# EAGLE design aux (EAGLE 9.6.2)
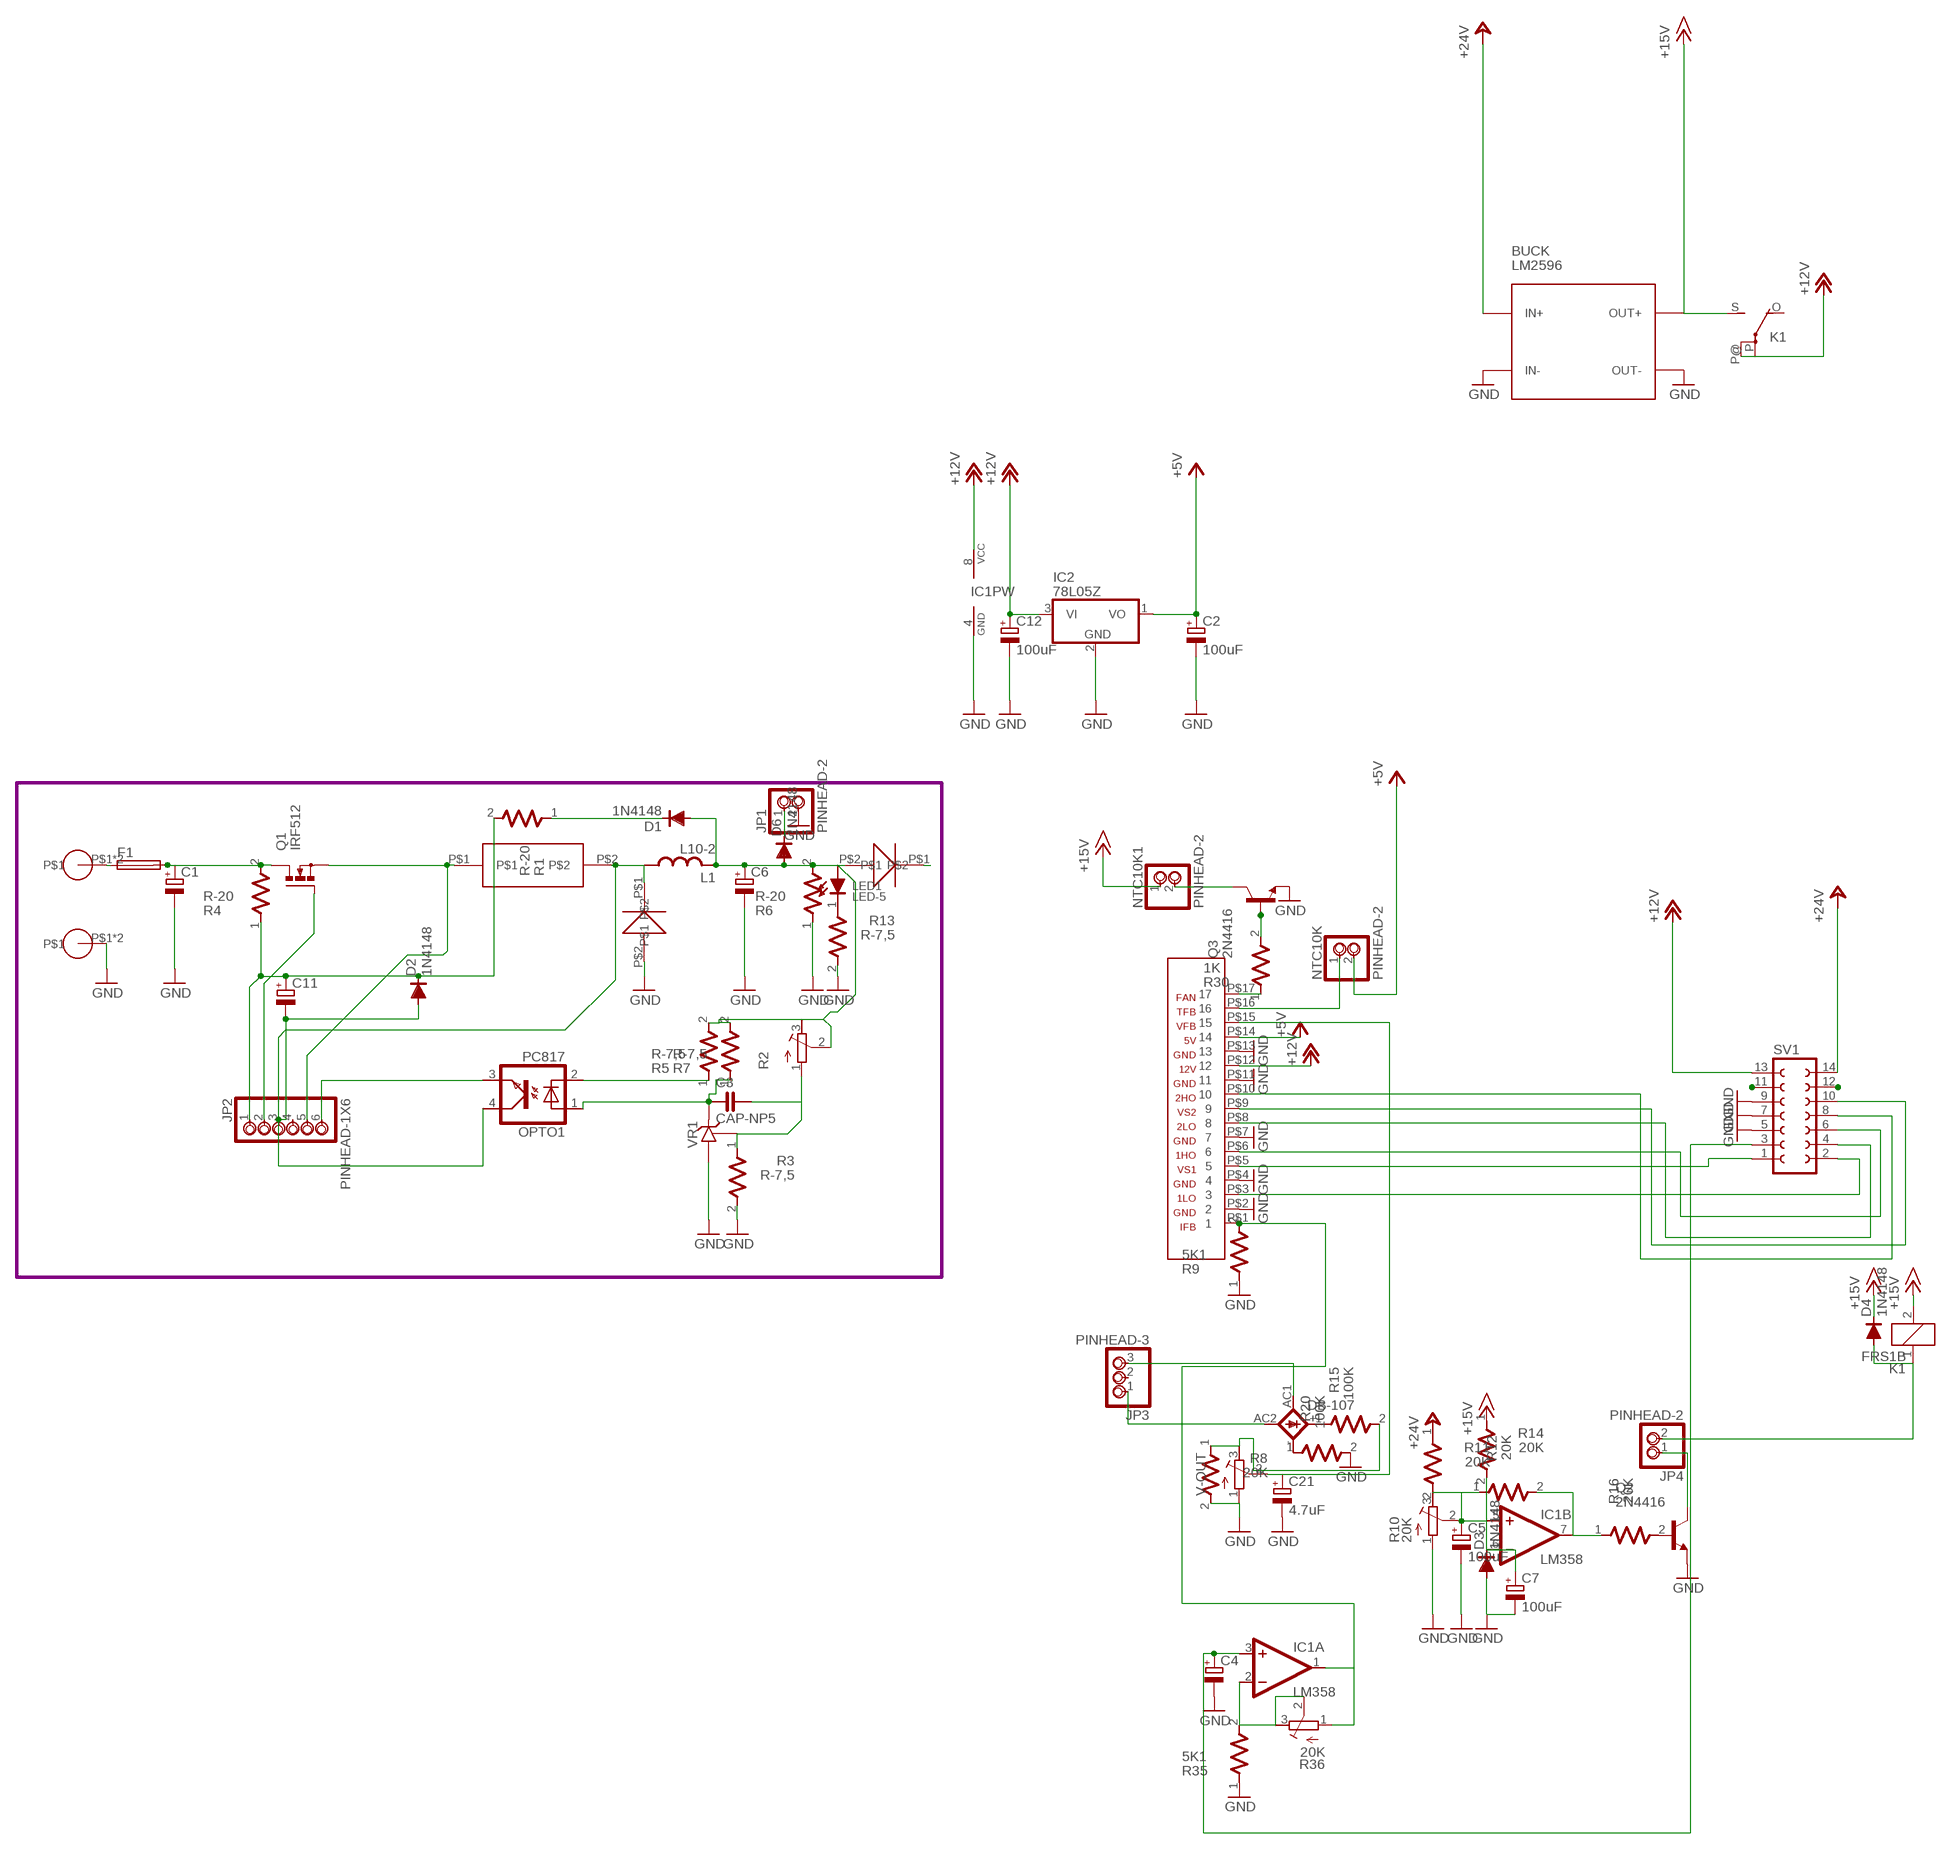
[diagram p0: schematic, sheet 1]

## Parts
BUCK  LM2596  DC-DC-STEP-DOWN-LM2596  [DC-DC-STEP-DOWN-LM2596]
C1  CPOL-EUE7.5-18  [E7,5-18]
C2  100uF  CPOL-EUE2.5-7  [E2,5-7]
C3  CAP-NP5  [CAP-NP5]
C4  CPOL-EUE2.5-7  [E2,5-7]
C5  100uF  CPOL-EUE2.5-7  [E2,5-7]
C6  CPOL-EUE7.5-18  [E7,5-18]
C7  100uF  CPOL-EUE2.5-7  [E2,5-7]
C11  CPOL-EUE5-8.5  [E5-8,5]
C12  100uF  CPOL-EUE2.5-7  [E2,5-7]
C21  4.7uF  CPOL-EUE2.5-7  [E2,5-7]
D1  1N4148  [D-7,5]
D2  1N4148  [D-7,5]
D3  1N4148  [D-7,5]
D4  1N4148  [D-7,5]
D6  1N4148  [D-7,5]
DB-107  CAU-1A  [CAU-1A]
F1  SH22  [SH22]
IC1  LM358  [DIL-8]
IC2  78L05Z  [TO92]
JP1  PINHEAD-2  [PINHEAD-2]
JP2  PINHEAD-1X6  [PINHEAD-1X6]
JP3  PINHEAD-3  [PINHEAD-3]
JP4  PINHEAD-2  [PINHEAD-2]
K1  FRS1B  [FRS1B]
L1  L10-2  [L10-2]
LED1  LED-5  [LED5]
NTC10K  PINHEAD-2  [PINHEAD-2]
NTC10K1  PINHEAD-2  [PINHEAD-2]
OPTO1  PC817  [DIL-04]
Q1  IRF512  [TO220BV]
Q2  2N4416  [TO92]
Q3  2N4416  [TO92]
R1  R-20  [R-20]
R2  R-TRIMM64W  [RTRIM64W]
R3  R-7,5  [R-7,5]
R4  R-20  [R-20]
R5  R-7,5  [R-7,5]
R6  R-20  [R-20]
R7  R-7,5  [R-7,5]
R8  20K  R-7,5  [R-7,5]
R9  5K1  R-7,5  [R-7,5]
R10  20K  R-TRIMM64W  [RTRIM64W]
R11  20K  R-7,5  [R-7,5]
R12  20K  R-7,5  [R-7,5]
R13  R-7,5  [R-7,5]
R14  20K  R-7,5  [R-7,5]
R15  100K  R-7,5  [R-7,5]
R16  20K  R-7,5  [R-7,5]
R20  100K  R-7,5  [R-7,5]
R30  1K  R-7,5  [R-7,5]
R35  5K1  R-7,5  [R-7,5]
R36  20K  R-TRIMM64W  [RTRIM64W]
SV1  FE07-2  [FE07-2]
U$1  DSEI6060A  [DSEI6060A]
U$2  DSEI6060A  [DSEI6060A]
U$3  PIN5MM  [PIN5MM]
U$4  PIN5MM  [PIN5MM]
U$5  SHUNT-0.01R  [SHUNT-0.01R]
U$11  EGS002  [EGS002]
V-OUT  R-TRIMM64W  [RTRIM64W]
VR1  TL431CLP  [TO92-CLP]

## Nets
+5V: C2.+ IC2.1(VO) NTC10K.2 U$11.P$14
+12V: C12.+ IC1.8(PW:VCC) IC2.3(VI) K1.P(2:P) K1.P@(2:P) SV1.13 U$11.P$12
+15V: BUCK.OUT+ D4.C K1.2 K1.S(2:S) NTC10K1.1 R14.1
+24V: BUCK.IN+ R11.1 SV1.14
GND: BUCK.IN- BUCK.OUT- C1.- C2.- C4.- C5.- C6.- C7.- C12.- C21.- D3.A IC1.4(PW:GND) IC2.2(GND) JP1.2 Q2.3(E) Q3.3(E) R3.2 R6.1 R8.2 R9.1 R10.1(A) R13.2 R20.2 R35.1 SV1.5 SV1.7 SV1.9 U$1.P$2 U$3.P$1 U$3.P$2 U$11.P$2 U$11.P$4 U$11.P$7 U$11.P$11 U$11.P$13 V-OUT.1(A) VR1.A
N$1: F1.1 U$4.P$1 U$4.P$2
N$3: JP2.2 Q1.G
N$4: D1.C R1.1
N$5: LED1.K R13.1
N$6: C5.+ IC1.5(B:+IN) R10.2(S) R10.3(E) R11.2 R12.1
N$7: OPTO1.2(C) R5.1
N$8: C4.+ IC1.3(A:+IN) SV1.3
N$9: SV1.11
N$10: C11.+ D2.C JP2.1 R1.2 R4.1
N$11: SV1.12
N$12: C3.2 R2.1(A) R3.1 VR1.R
N$13: SV1.2 U$11.P$3
N$14: JP2.5 Q1.S U$5.P$1
N$16: C1.+ F1.2 Q1.D R4.2
N$17: C3.1 OPTO1.1(A) R7.1 VR1.C
N$18: C6.+ D1.A D6.A L1.P$3 L1.P$4 LED1.A R2.2(S) R2.3(E) R5.2 R6.2 R7.2 U$2.P$2
N$19: R8.1 R15.2 V-OUT.3(E)
N$20: SV1.6 U$11.P$6
N$21: D6.C JP1.1
N$22: SV1.4 U$11.P$8
N$23: IC1.2(A:-IN) R35.2 R36.2(S) R36.3(E)
N$24: SV1.10 U$11.P$9
N$25: SV1.8 U$11.P$10
N$26: R30.1 U$11.P$17
N$27: DB-107.AC2(-) JP3.1
N$28: IC1.7(B:OUT) R12.2 R16.1
N$29: C7.+ D3.C IC1.6(B:-IN) R14.2
N$30: C11.- D2.A JP2.3 L1.P$1 L1.P$2 OPTO1.4(COL) U$1.P$1 U$5.P$2
N$31: Q2.2(B) R16.2
N$32: JP4.1 Q2.1(C)
N$33: D4.A JP4.2 K1.1
N$35: SV1.1 U$11.P$5
N$36: JP2.6 OPTO1.3(EMI)
N$37: Q3.2(B) R30.2
N$40: C21.+ U$11.P$15 V-OUT.2(S)
N$41: NTC10K1.2 Q3.1(C)
N$45: DB-107.+ R15.1
N$47: DB-107.-(AC2) R20.1
N$48: NTC10K.1 U$11.P$16
N$51: IC1.1(A:OUT) R9.2 R36.1(A) U$11.P$1
N$53: DB-107.AC1 JP3.3
VCC: U$2.P$1
Unconnected: JP2.4 JP3.2 K1.O(2:O)

## Library data of the parts
BUCK = diy-modules:DC-DC-STEP-DOWN-LM2596: DC/DC Step-Down Regulator based on LM2596-ADJ chip LM2596 datasheet available here: http://www.ti.com/lit/ds/symlink/lm2596.pdf Click here to find device on ebay.com <http://www.ebay.com/sch/lm2596+power+regulator>
C1 C2 C4-C7 C11 C12 C21 = LBR inverter true sine:CPOL-EU: POLARIZED CAPACITOR, European symbol
C3 = chuong:CAP-NP5
D1-D4 D6 = chuong:1N4148
DB-107 = lbr:CAU-1A
F1 = fuse:SH22: FUSE HOLDER CS PFP30, Schukat; OC_FARNELL: unknown; OC_NEWARK: unknown
IC1 = LBR inverter true sine:LM358
IC2 = chuong:78*: Positive VOLTAGE REGULATOR Source: http://cache.national.com/ds/LM/LM78L05.pdf http://www.fairchildsemi.com/ds/LM/LM7805.pdf
JP1 JP4 = chuong:PINHEAD-2
JP2 = chuong:PINHEAD-1X6
JP3 = chuong:PINHEAD-3
K1 = relay:FRS1B: RELAY 1 x switch, same as V23101-D6-A201, Siemens; OC_FARNELL: unknown; OC_NEWARK: unknown
L1 = lbr:L10-2
LED1 = chuong:LED-5
NTC10K NTC10K1 = LBR inverter true sine:PINHEAD-2
OPTO1 = chuong:PC817
Q1 = LBR inverter true sine:IRF512: N-CHANNEL MOS FET
Q2 Q3 = lbr:2N4416: NPN Transistor
R1 R4 R6 = chuong:R-20
R2 R10 R36 V-OUT = chuong:R-TRIMM: Trimm resistor
R3 R5 R7-R9 R11-R16 R20 R30 R35 = chuong:R-7,5
SV1 = con-lsta:FE07-2: FEMALE HEADER; OC_FARNELL: unknown; OC_NEWARK: unknown
U$1 U$2 = LBR-NEW:DSEI6060A
U$3 U$4 = LBR inverter true sine:PIN5MM
U$5 = Shunt 0.01R:SHUNT-0.01R
U$11 = LBR inverter true sine:EGS002
VR1 = chuong:TL431CLP: VOLTAGE REGULATOR

## Board
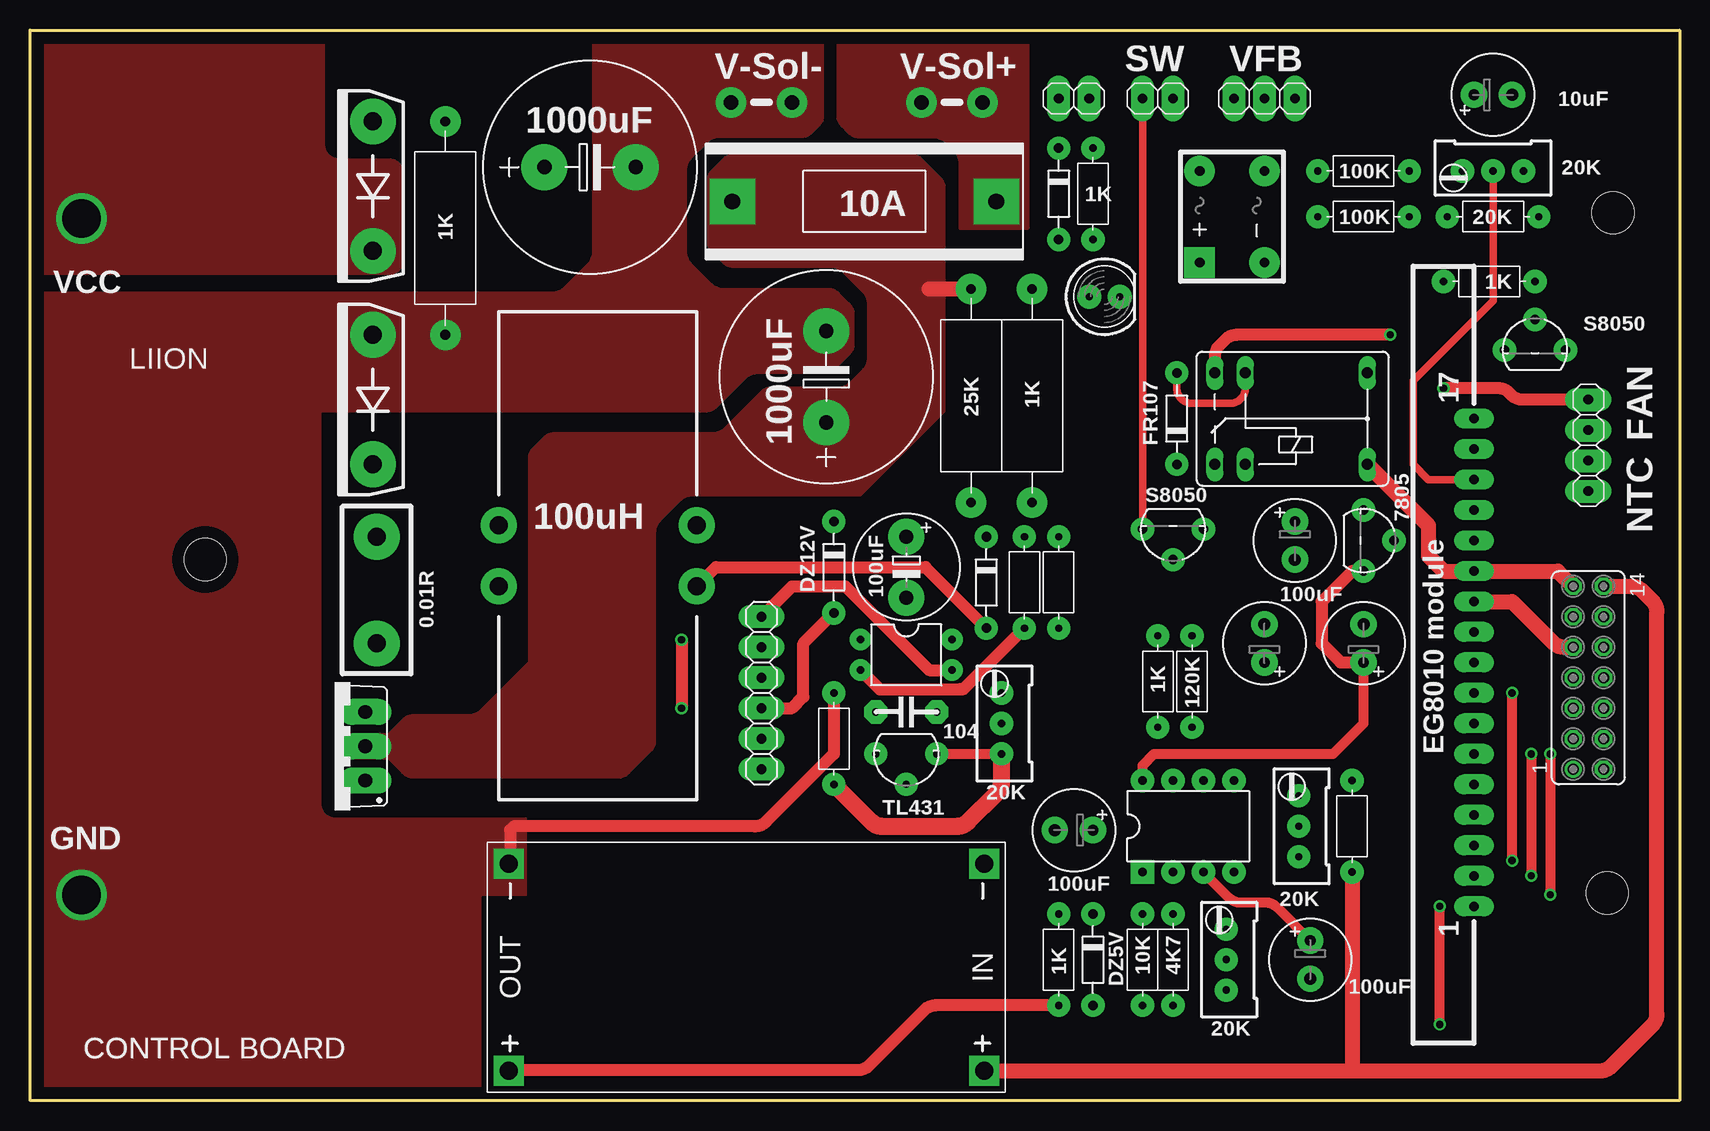
[diagram p1: board, top side]
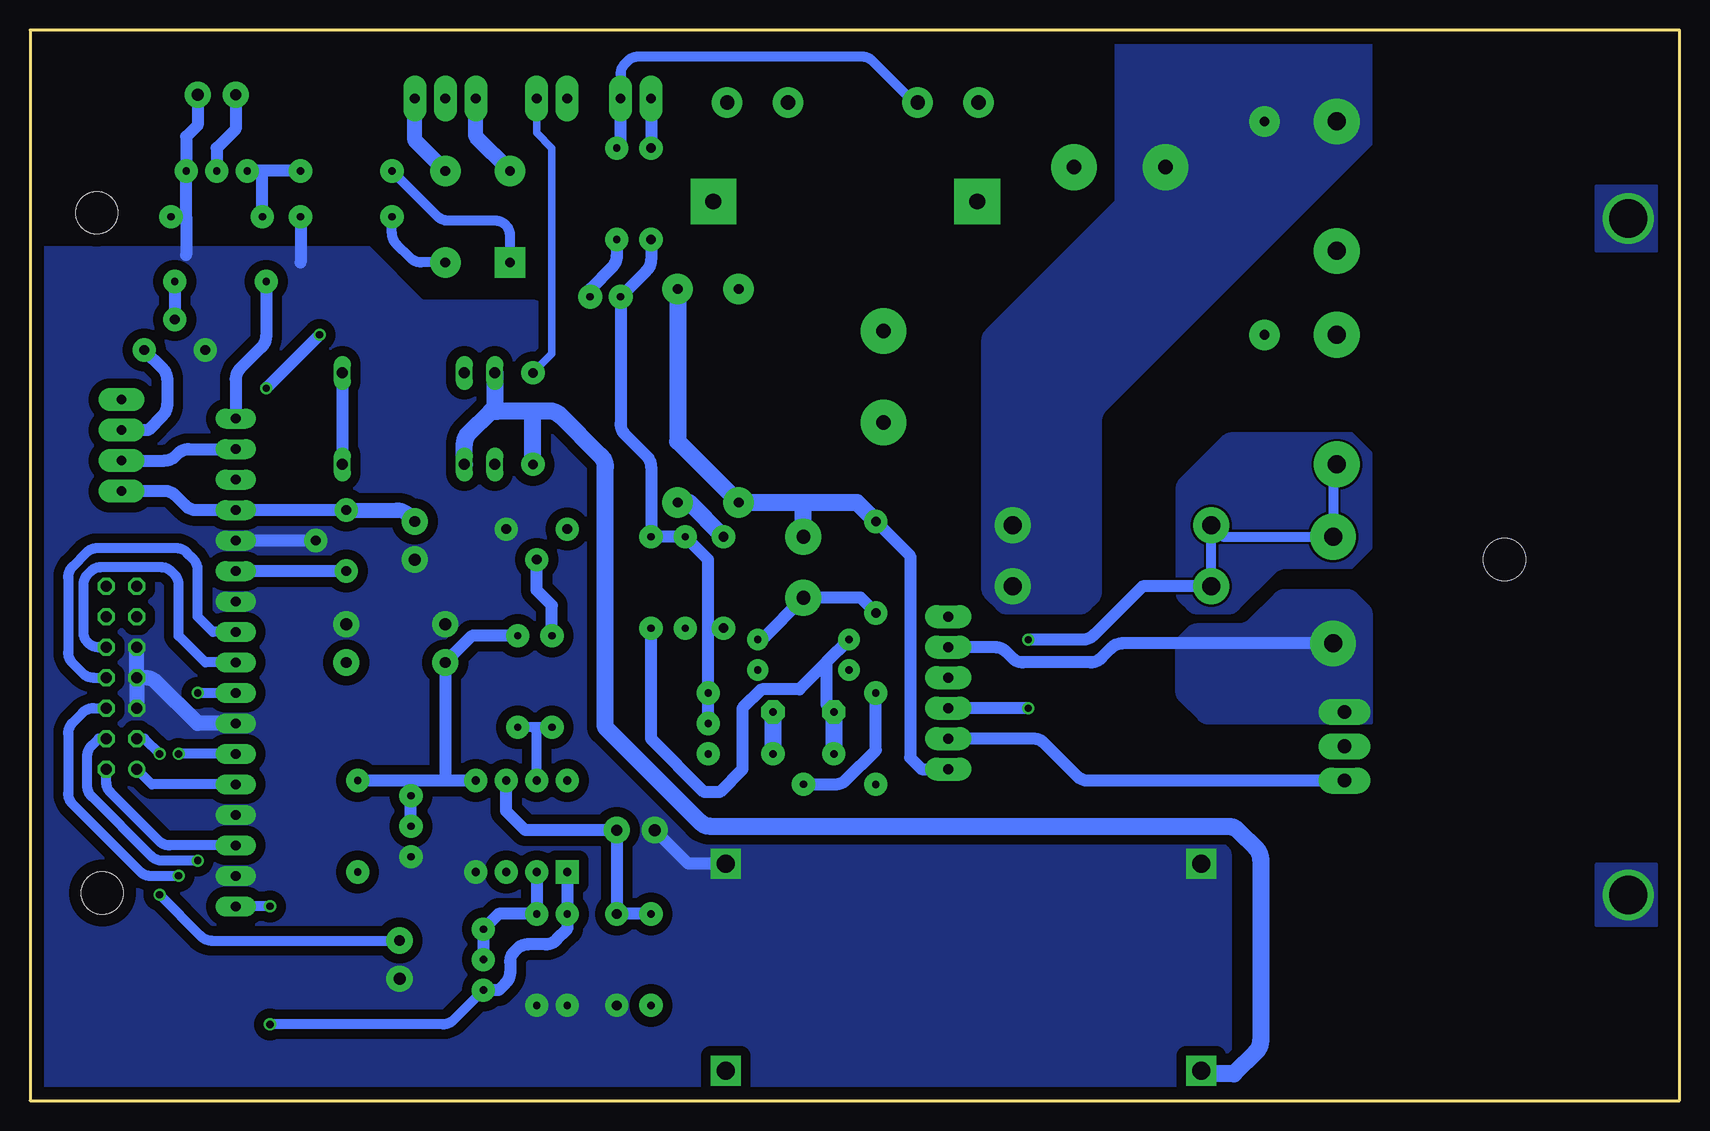
[diagram p2: board, bottom side, seen from below]

Size 137.48 x 89.22 mm. Coordinates in mm from the lower left corner, seen from the top.
Outline: 137.48,0 0,0 0,89.22 137.48,89.22 137.48,0
Copper layers (1*16): Top 0.035mm / dielectric 1.5mm / Bottom 0.035mm
Design rules "default": minimum track width 10mil, minimum drill 24mil, track to track 8mil, track to pad 8mil, pad to pad 8mil, via to via 8mil, smd to smd 8mil, copper to edge 40mil, drill to drill 8mil, minimum pad ring 10mil, minimum via ring 8mil, stop-mask expansion 4mil, vias tented up to drill 0mil, thermal gap 10mil
Holes 3.5 mm at 131.44,17.3 14.6,45.09 131.92,73.98

### Footprints (pad centres in the part's own frame; a part is rotated, then mirrored left to right if it is on the bottom)
DC-DC-STEP-DOWN-LM2596 = drill 1.5 pad 2.5 square: IN+ -19.812,8.636; IN- -19.812,-8.636; OUT+ 19.812,8.636; OUT- 19.812,-8.636
E7,5-18 = drill 1.2 pad 3.81: + -3.81,0; - 3.81,0
E2,5-7 = drill 0.9 pad 2.184: + -1.587,0 | drill 1 pad 2.184: - 1.587,0
CAP-NP5 = drill 0.61 pad 1.93 octagon: 1 -3.81,0; 2 1.27,0
E5-8,5 = drill 1.15 pad 3: + -2.54,0; - 2.54,0
D-7,5 = drill 0.8 pad 1.93: A 3.81,0; C -3.81,0
CAU-1A = drill 0.813 pad 2.54 square: + -2.857,2.54 | drill 0.813 pad 2.54: - -2.857,-2.857; AC1 4.763,2.54; AC2 4.763,-2.857
SH22 = drill 1.321 pad 3.81 square: 1 -10.998,0; 2 10.998,0
DIL-8 = drill 0.7 pad 1.93 square: 1 -3.81,-3.81 | drill 0.7 pad 1.93: 2 -1.27,-3.81; 3 1.27,-3.81; 4 3.81,-3.81; 5 3.81,3.81; 6 1.27,3.81; 7 -1.27,3.81; 8 -3.81,3.81
TO92 = drill 0.813 pad 1.93: 1 -2.54,0; 2 0,2.54; 3 2.54,0
PINHEAD-2 = drill 0.813 pad 1.93 long: 1 -1.27,0; 2 1.27,0
PINHEAD-1X6 = drill 0.813 pad 1.93 long: 1 -5.08,0; 2 -2.54,0; 3 0,0; 4 2.54,0; 5 5.08,0; 6 7.62,0
PINHEAD-3 = drill 0.813 pad 1.93 long: 1 -2.54,0; 2 0,0; 3 2.54,0
FRS1B = drill 0.914 long: 1 0,3.81; 2 0,-3.81; O -2.54,-3.81; P 10.16,3.81; P@ 10.16,-3.81; S -2.54,3.81
L10-2 = drill 1.5 pad 3: P$1 -8.89,2.54; P$2 -8.89,-2.54; P$3 7.62,-2.54; P$4 7.62,2.54
LED5 = drill 0.61 pad 2: A -1.27,0; K 1.27,0
DIL-04 = drill 0.61 pad 1.778: 1 -1.27,-3.81; 2 1.27,-3.81; 3 1.27,3.81; 4 -1.27,3.81
TO220BV = drill 1.15 pad 2.184 long: D 0,-2.54; G -2.857,-2.54; S 2.857,-2.54
TO92' = drill 0.813 pad 1.93: 1 2.54,0; 2 0,2.54; 3 -2.54,0
R-20 = drill 0.813 pad 2.54: 1 -8.89,0; 2 8.89,0
RTRIM64W = drill 0.61 pad 1.93: 1 0,-2.54; 2 0,0; 3 0,2.54
R-7,5 = drill 0.61 pad 1.93: 1 -3.81,0; 2 3.81,0
FE07-2 = drill 0.914: 1 -7.62,1.27 | drill 0.914 octagon: 2 -7.62,-1.27; 3 -5.08,1.27; 4 -5.08,-1.27; 5 -2.54,1.27; 6 -2.54,-1.27; 7 0,1.27; 8 0,-1.27; 9 2.54,1.27; 10 2.54,-1.27; 11 5.08,1.27; 12 5.08,-1.27; 13 7.62,1.27; 14 7.62,-1.27
DSEI6060A = drill 1.5 pad 3.81: P$1 -11.748,2.54; P$2 -0.953,2.54
PIN5MM = drill 1.2 pad 2.54: P$1 -2.54,0; P$2 2.54,0
SHUNT-0.01R = drill 1.5 pad 3.81: P$1 -2.54,-1.27; P$2 6.35,-1.27
EGS002 = drill 0.8 pad 1.676 long: P$1 -19.05,-1.27; P$2 -16.51,-1.27; P$3 -13.97,-1.27; P$4 -11.43,-1.27; P$5 -8.89,-1.27; P$6 -6.35,-1.27; P$7 -3.81,-1.27; P$8 -1.27,-1.27; P$9 1.27,-1.27; P$10 3.81,-1.27; P$11 6.35,-1.27; P$12 8.89,-1.27; P$13 11.43,-1.27; P$14 13.97,-1.27; P$15 16.51,-1.27; P$16 19.05,-1.27; P$17 21.59,-1.27
TO92-CLP = drill 0.6 pad 1.93: A 0,2.54; C 2.54,0; R -2.54,0

### Placement (x,y rotation side)
BUCK  59.69,11.11 180 top
C1  66.36,60.32 90 top
C2  105.41,46.67 270 top
C3  74.3,32.38 0 top
C4  106.68,11.75 270 top
C5  102.87,38.1 90 top
C6  46.67,77.79 0 top
C7  87,22.54 180 top
C11  73.03,44.45 270 top
C12  111.12,38.1 90 top
C21  121.92,83.82 0 top
D1  79.69,43.18 270 top
D2  66.99,44.45 270 top
D3  88.58,11.75 270 top
D4  95.57,56.83 90 top
D6  85.72,75.56 270 top
DB-107  100.01,72.71 90 top
F1  69.53,74.93 180 top
IC1  96.52,22.86 0 top
IC2  111.12,46.67 270 top
JP1  87,83.5 0 top
JP2  60.96,32.7 90 top
JP3  102.87,83.5 180 top
JP4  93.98,83.5 0 top
K1  101.28,56.83 0 top
L1  47.94,45.4 0 top
LED1  89.53,66.99 0 top
NTC10K  129.86,52.07 270 top
NTC10K1  129.86,57.15 270 top
OPTO1  73.03,37.15 270 top
Q1  25.4,29.53 90 top
Q2  2N4416  [TO92']  95.25,47.62 180 top
Q3  2N4416  [TO92']  125.41,62.55 0 top
R1  83.5,58.74 90 top
R2  80.96,31.43 0 top
R3  66.99,30.16 90 top
R4  78.42,58.74 90 top
R5  82.87,43.18 90 top
R6  34.61,72.71 90 top
R7  85.72,43.18 90 top
R8  121.92,73.66 0 top
R9  92.71,11.75 90 top
R10  105.73,22.86 0 top
R11  110.17,22.86 90 top
R12  96.84,34.92 270 top
R13  88.58,75.56 90 top
R14  85.72,11.75 90 top
R15  111.12,77.47 0 top
R16  93.98,34.92 90 top
R20  111.12,73.66 0 top
R30  121.6,68.26 0 top
R35  95.25,11.75 90 top
R36  99.7,11.75 0 top
SV1  129.86,35.24 90 top
U$1  31.12,64.77 90 top
U$2  31.12,82.55 90 top
U$3  60.96,83.19 0 top
U$4  76.84,83.19 0 top
U$5  27.62,40.64 90 top
U$11  119.06,35.24 90 top
V-OUT  121.92,77.47 90 top
VR1  73.03,28.89 180 top

### Tracks (layer width: path | path; a pad name or v marks a point on that pad's centre or on a via)
+5V
  Bottom 1.016: NTC10K.2 126.26,50.8 arc45 125.36,50.43 124.51,49.58 arc-45 123.62,49.21 U$11.P$14 IC2.1
  Bottom 1.27: IC2.1 106.89,49.21 arc45 105.99,48.84 C2.+
+12V
  Top 0.813: IC1.8 92.71,27.94 93.66,28.89 108.59,28.89 111.12,31.43 C12.+
  Top 1.016: IC2.3 110.17,44.13 107.63,41.59 107.63,38.1 109.22,36.51 C12.+
  Top 1.27: SV1.13 127.32,44.13 U$11.P$12 117.79,44.13 116.52,45.4 116.52,47.94 K1.P@
  Bottom 1.016: K1.P K1.P@ | IC2.3 U$11.P$12
+15V  (via drill 0.6)
  Top 1.016: NTC10K1.1 124.35,58.42 arc-45 123.45,58.79 123.24,59 arc45 122.35,59.37 v117.79,59.37 | v113.35,63.82 100.54,63.82 arc45 99.64,63.45 99.11,62.92 arc45 98.74,62.02 K1.S | R14.1 75.46,7.94 arc45 74.56,7.57 69.9,2.91 arc-45 69.01,2.54 39.94,2.54 BUCK.OUT+
  Bottom 1.016: v117.79,59.37 v113.35,63.82
  Bottom 1.422: K1.S 98.74,57.78 | 98.74,57.78 99.06,57.47 | K1.2 101.28,54.72 arc45 100.91,55.62 99.06,57.47 | 95.57,57.47 94.19,57.47 arc45 93.29,57.1 89.91,53.71 arc45 89.53,52.81 89.53,31.11 81.65,23.23 arc-45 80.75,22.86 37.67,22.86 arc45 36.78,22.49 35.3,21.01 arc45 34.93,20.11 34.93,4.97 arc45 35.3,4.07 37.15,2.22 39.62,2.22 BUCK.OUT+ | 95.57,57.47 98.42,57.47 | 98.42,57.47 98.74,57.78 | 99.06,57.47 98.42,57.47 | D4.C 95.57,57.47
+24V
  Top 1.27: SV1.14 133.46,42.86 arc-45 134.36,42.49 135.2,41.65 arc-45 135.57,40.75 135.57,7.19 arc-45 135.2,6.3 131.75,2.85 arc-45 130.85,2.48 110.49,2.48 | BUCK.IN+ 110.49,2.48 | R11.1 110.17,2.79 110.49,2.48
GND  (via drill 3.2)
  Top 1.016: R3.2 66.99,28.89 61.33,23.23 arc-45 60.43,22.86 40.32,22.86 40.01,22.54 40.01,19.88 BUCK.OUT-
  Top 1.27: U$11.P$11 123.51,41.59 126.95,38.15 arc45 127.84,37.78 SV1.9
  Bottom 0.813: U$3.P$2 63.82,83.19 67.26,86.62 arc-45 68.15,87 86.79,87 arc-45 87.68,86.62 87.89,86.41 arc-45 88.27,85.52 JP1.2
  Bottom 1.016: C21.- 123.51,81.28 124.46,80.33 V-OUT.1 124.46,73.66 | R8.2 124.46,73.66 | IC2.2 U$11.P$13 | BUCK.IN- 82.61,19.75 C7.- | 124.46,73.66 124.46,70.49 | R20.2 114.94,69.85 | R13.2 88.27,79.69 JP1.2 | VR1.A 70.38,26.35 arc-45 69.48,26.72 66.99,29.21 R3.2
  Bottom 1.27: SV1.7 SV1.5 | SV1.7 SV1.9 | U$11.P$7 123.51,31.43 126.95,34.87 arc-45 127.84,35.24 SV1.7
  other vias: 4.29,17.15
  pour Bottom (isolate 0.813, no thermals): 136.84,71.12 109.22,71.12 104.78,66.67 95.78,66.67 arc45 94.88,66.3 88,59.43 arc45 87.63,58.53 87.63,29.21 80.01,21.59 38.73,21.59 arc90 37.47,20.32 37.47,0.32 136.84,0.32
  pour Top (no thermals): 59.64,60.27 57.2,57.84 arc-45 56.31,57.47 24.13,57.47 24.13,24.77 arc90 25.4,23.49 41.27,23.49 41.27,17.15 37.47,17.15 37.47,0.32 0.63,0.32 0.63,67.31 43.61,67.31 arc45 44.5,67.68 46.62,69.8 arc45 46.99,70.69 46.99,88.58 66.04,88.58 66.04,82.12 arc-45 65.67,81.23 65.14,80.7 arc-45 64.24,80.33 57.36,80.33 arc45 56.46,79.96 54.98,78.48 arc45 54.61,77.58 54.61,70.69 arc45 54.98,69.8 56.78,68 arc45 57.68,67.63 66.47,67.63 arc-45 67.36,67.26 68.21,66.41 arc-45 68.58,65.51 68.58,63.07 arc-45 68.21,62.18 67.05,61.01 arc-45 66.15,60.64 60.53,60.64 arc45
  pour Bottom (no thermals): 1.9,19.69 6.98,19.69 6.98,14.6 1.9,14.6
N$1
  pour Top (no thermals): 83.19,88.58 67.31,88.58 67.31,82.12 arc45 67.68,81.23 68.21,80.7 arc45 69.11,80.33 75.36,80.33 arc-45 76.25,79.96 77.1,79.11 arc-45 77.47,78.21 77.47,72.71 83.19,72.71
N$2
  pour Bottom (no thermals): 32.38,55.56 37.26,55.56 arc-45 38.15,55.19 41.54,51.81 arc-45 41.91,50.91 41.91,42.44 arc-45 41.54,41.54 41.01,41.01 arc-45 40.11,40.64 37.67,40.64 arc-45 36.78,41.01 33.71,44.08 arc45 32.81,44.45 27.3,44.45 25.72,46.04 25.72,53.98 27.3,55.56
N$3
  Bottom 1.016: Q1.G 49.32,26.67 arc45 50.22,27.04 52.97,29.79 arc-45 53.87,30.16 JP2.2
N$4
  Bottom 1.422: D1.C 82.55,49.85 R1.1
N$5
  Bottom 1.016: R13.1 88.58,70.38 arc45 88.95,69.48 90.81,67.63 LED1.K
N$6
  Bottom 1.016: IC1.5 102.87,26.67 | 102.87,26.67 105.73,26.67 | 105.73,26.67 R11.2 | R10.2 R10.3 105.73,26.67 | 102.87,26.67 C5.+ 100.65,38.74 R12.1
N$7
  Top 1.016: OPTO1.2 70.81,34.28 77.5,34.28 77.51,34.29 77.79,34.29 R5.1
N$8  (via drill 0.6)
  Top 0.813: v126.68,28.89 v126.68,17.15 | IC1.3 99.96,16.88 arc45 100.86,16.51 102.98,16.51 arc-45 103.88,16.14 C4.+
  Bottom 0.813: SV1.3 127.95,30.16 v126.68,28.89 | v126.68,17.15 123.24,13.71 arc-45 122.35,13.33 C4.+
N$10
  Bottom 1.016: D2.C 64.14,45.4 64.14,28.58 63.18,27.62 JP2.1
  Bottom 1.422: R1.2 83.5,54.93 R4.1 73.03,49.85 | 73.03,49.85 68.58,49.85 D2.C | C11.+ 73.03,49.85
N$12
  Top 0.813: VR1.R R2.1
  Top 1.422: R3.1 70.11,23.23 arc45 71.01,22.86 77.26,22.86 arc45 78.16,23.23 80.59,25.66 arc45 80.96,26.56 R2.1
  Bottom 1.422: C3.2 VR1.R
N$13
  Bottom 0.813: U$11.P$3 125.84,21.27 arc45 126.74,21.64 130.76,25.66 arc45 131.13,26.56 SV1.2
N$14
  Bottom 1.016: U$5.P$1 46.46,38.1 arc-45 47.36,37.73 48.21,36.88 arc45 49.1,36.51 54.72,36.51 arc45 55.62,36.88 56.14,37.41 arc-45 57.04,37.78 JP2.5
  pour Bottom (no thermals): 41.91,38.42 41.01,39.32 arc45 40.11,39.69 36.72,39.69 arc-45 35.82,40.06 33.71,42.17 arc45 32.81,42.55 27.83,42.55 arc45 26.93,42.17 26.09,41.33 arc45 25.72,40.43 25.72,31.43 39.16,31.43 arc45 40.06,31.8 41.54,33.28 arc45 41.91,34.18
N$16
  Top 1.27: R4.2 74.93,67.63
  pour Top (no thermals): 76.2,57.47 76.2,75.99 arc45 75.83,76.89 74.35,78.37 arc45 73.45,78.74 58.63,78.74 arc45 57.73,78.37 56.89,77.52 arc45 56.52,76.63 56.52,71.65 arc45 56.89,70.75 57.73,69.9 arc45 58.63,69.53 66.78,69.53 arc-45 67.68,69.16 69.48,67.36 arc-45 69.85,66.47 69.85,61.8 arc-45 69.48,60.91 68.32,59.74 arc-45 67.42,59.37 61.8,59.37 arc45 60.91,59 57.84,55.93 arc-45 56.94,55.56 43.71,55.56 arc45 42.81,55.19 41.96,54.35 arc45 41.59,53.45 41.59,36.51 37.52,32.44 arc-45 36.62,32.07 31.96,32.07 arc45 31.06,31.7 29.84,30.48 26.67,30.48 26.67,28.58 29.84,28.58 31.06,27.36 arc45 31.96,26.99 49,26.99 arc45 49.9,27.36 51.7,29.16 arc45 52.07,30.05 52.07,47.42 arc-45 52.44,48.31 54.24,50.11 arc-45 55.14,50.48 69.22,50.48
N$17
  Bottom 1.016: OPTO1.1 71.12,36.51 | C3.1 71.12,33.02 71.12,36.51 | 71.12,36.51 73.36,34.28 76.52,34.28 78.11,32.69 78.11,27.62 80.01,25.72 81.28,25.72 85.72,30.16 R7.1
  Bottom 1.422: C3.1 VR1.C
N$18
  Top 1.016: L1.P$3 57.15,44.45 74.61,44.45 D1.A
  Bottom 1.016: D6.A 85.72,70.06 arc45 86.1,69.16 LED1.A 88.27,56.41 arc-45 87.89,55.51 86.1,53.71 arc45 85.72,52.81 R7.2 R5.2 80.96,45.09 80.96,39.69 | R2.2 R2.3 80.96,39.69 | D1.A 80.64,39.37 80.96,39.69
  pour Bottom (no thermals): 25.72,88.58 46.99,88.58 46.99,74.93 57.73,64.19 arc-45 58.1,63.29 58.1,42.75 arc-45 57.73,41.86 56.89,41.01 arc-45 55.99,40.64 50.06,40.64 arc-45 49.16,41.01 48.63,41.54 arc-45 48.26,42.44 48.26,56.62 arc45 47.89,57.52 25.72,79.69
N$19
  Bottom 1.016: R15.2 118.43,77.47 | 118.43,77.47 V-OUT.3 | R8.1 118.11,77.15 118.43,77.47
N$20  (via drill 0.6)
  Top 0.813: v125.09,28.89 v125.09,18.73
  Bottom 0.813: U$11.P$6 v125.09,28.89 | v125.09,18.73 127.43,18.73 arc45 128.32,19.1 133.93,24.71 arc45 134.3,25.61 134.3,30.59 arc45 133.93,31.49 133.09,32.33 arc45 132.19,32.7 SV1.6
N$21
  Bottom 1.016: JP1.1 D6.C
N$22  (via drill 0.6)
  Top 0.813: v123.51,20 v123.51,33.97
  Bottom 0.813: SV1.4 131.76,30.16 132.34,29.58 arc-45 132.72,28.68 132.72,26.24 arc-45 132.34,25.35 127.37,20.37 arc-45 126.47,20 v123.51,20 | v123.51,33.97 U$11.P$8
N$23
  Bottom 1.016: IC1.2 R35.2 98.42,15.56 R36.3 R36.2
N$24
  Bottom 0.813: U$11.P$9 122.87,36.51 125.09,38.74 125.09,42.97 arc-45 125.47,43.87 125.68,44.08 arc-45 126.57,44.45 131.55,44.45 arc-45 132.45,44.08 132.66,43.87 arc-45 133.03,42.97 133.03,39.05 arc-90 131.76,37.78 SV1.10
N$25
  Bottom 0.813: U$11.P$10 122.24,39.05 123.51,40.32 123.51,44.24 arc-45 123.88,45.14 124.41,45.67 arc-45 125.3,46.04 131.87,46.04 arc-45 132.77,45.67 133.93,44.5 arc-45 134.3,43.61 134.3,37.36 arc-45 133.93,36.46 133.09,35.61 arc-45 132.19,35.24 SV1.8
N$26
  Bottom 1.016: R30.1 117.79,63.71 arc45 118.16,62.81 119.96,61.01 arc-45 120.33,60.12 U$11.P$17
N$27
  Bottom 1.27: DB-107.AC2 105.41,80.01 JP3.1
N$28
  Bottom 0.813: R16.1 95.57,31.11 | 95.57,31.11 R12.2 | IC1.7 95.25,30.8 95.57,31.11
N$29
  Bottom 1.016: IC1.6 97.79,24.13 96.2,22.54 C7.+ D3.C R14.2
N$30  (via drill 0.6)
  Top 1.016: v54.29,38.42 v54.29,32.7 | D2.A 64.45,38.1 64.45,33.66 63.5,32.7 JP2.3
  Bottom 0.813: U$1.P$1 28.89,52.7 U$5.P$2 38.1,46.99 L1.P$1 L1.P$2
  Bottom 1.016: L1.P$2 44.77,42.86 48.84,38.79 arc45 49.74,38.42 v54.29,38.42 | v54.29,32.7 JP2.3 | D2.A 68.26,41.91 C11.- 76.52,38.42 OPTO1.4
N$31
  Bottom 1.016: R16.2 93.98,41.28 95.25,42.55 Q2.2
N$32
  Top 0.61: JP4.1 Q2.1
N$33
  Top 0.61: K1.1 101.28,59.37 arc-90 100.01,58.1 96.84,58.1 arc-90 95.57,59.37 D4.A
  Bottom 0.61: JP4.2 95.25,80.64 93.98,79.38 93.98,62.23 D4.A
N$35
  Bottom 0.813: U$11.P$5 127.32,26.35 SV1.1
N$36
  Top 1.016: JP2.6 63.5,42.86 67.95,42.86 74.93,35.88 OPTO1.3
N$37
  Bottom 1.016: R30.2 Q3.2
N$40
  Top 0.61: U$11.P$15 116.52,51.75 115.25,53.02 115.25,60.01 121.92,66.67 V-OUT.2
  Bottom 1.016: C21.+ 120.33,80.96 121.92,79.38 V-OUT.2
N$41
  Bottom 1.016: Q3.1 126.42,61.01 arc45 126.05,60.12 126.05,57.99 arc45 126.42,57.1 127.63,55.88 NTC10K1.2
N$45
  Bottom 0.813: DB-107.+ 97.47,72.07 arc-90 98.74,73.34 102.66,73.34 arc45 103.56,73.71 R15.1
N$47
  Bottom 0.813: DB-107.- 104.88,69.85 arc45 105.78,70.22 106.94,71.38 arc45 107.31,72.28 R20.1
N$48
  Bottom 1.016: NTC10K.1 126.26,53.34 arc-45 125.36,53.71 125.15,53.92 arc45 124.25,54.29 U$11.P$16
N$51  (via drill 0.6)
  Top 0.813: v117.47,6.35 v117.47,16.19
  Bottom 0.813: R36.1 102.18,6.72 arc45 103.08,6.35 v117.47,6.35 | v117.47,16.19 U$11.P$1
  Bottom 1.016: IC1.1 R9.2 92.71,14.29 93.61,13.39 arc45 94.51,13.02 95.99,13.02 arc-45 96.89,12.65 97.1,12.44 arc-45 97.47,11.54 97.47,10.69 arc45 97.84,9.79 98.42,9.21 R36.1
N$53
  Bottom 1.27: DB-107.AC1 100.33,80.33 JP3.3
VCC  (via drill 3.2)
  other vias: 4.29,73.5
  pour Top (no thermals): 25.72,78.42 29.84,78.42 arc-90 31.12,77.15 31.12,70.17 arc-90 29.84,68.9 1.9,68.9 0.63,68.9 0.63,88.58 24.45,88.58 24.45,79.69 arc90
  pour Bottom (no thermals): 1.9,76.2 6.98,76.2 6.98,70.8 1.9,70.8

### Text on the board
tPlace: SW | VFB | V-Sol- | V-Sol+ | 10uF | 1000uF | 100K | 20K | 10A | 1K | 1K | 100K | 20K | VCC | 1K | S8050 | LIION | FAN | 25K | 1K | FR107 | 1000uF | NTC | S8050 | DZ12V | 7805 | 100uH | 100uF | 100uF | 0.01R | 1K | 120K | 104 | TL431 | 20K | GND | 100uF | 20K | 1K | 10K | 4K7 | DZ5V | 100uF | 20K | CONTROL BOARD | CONTROL BOARD